# Altium schematic sheet Alimentation.SchDoc
size A4; Author: Jérémie Jean-Elie; Organization: ETML-ES; Address1: Avenue Recordon 1; Address2: 1004 Lausanne; Address3: Switzerland; Revision: 1; SheetNumber: 2; SheetTotal: 7; Version: E
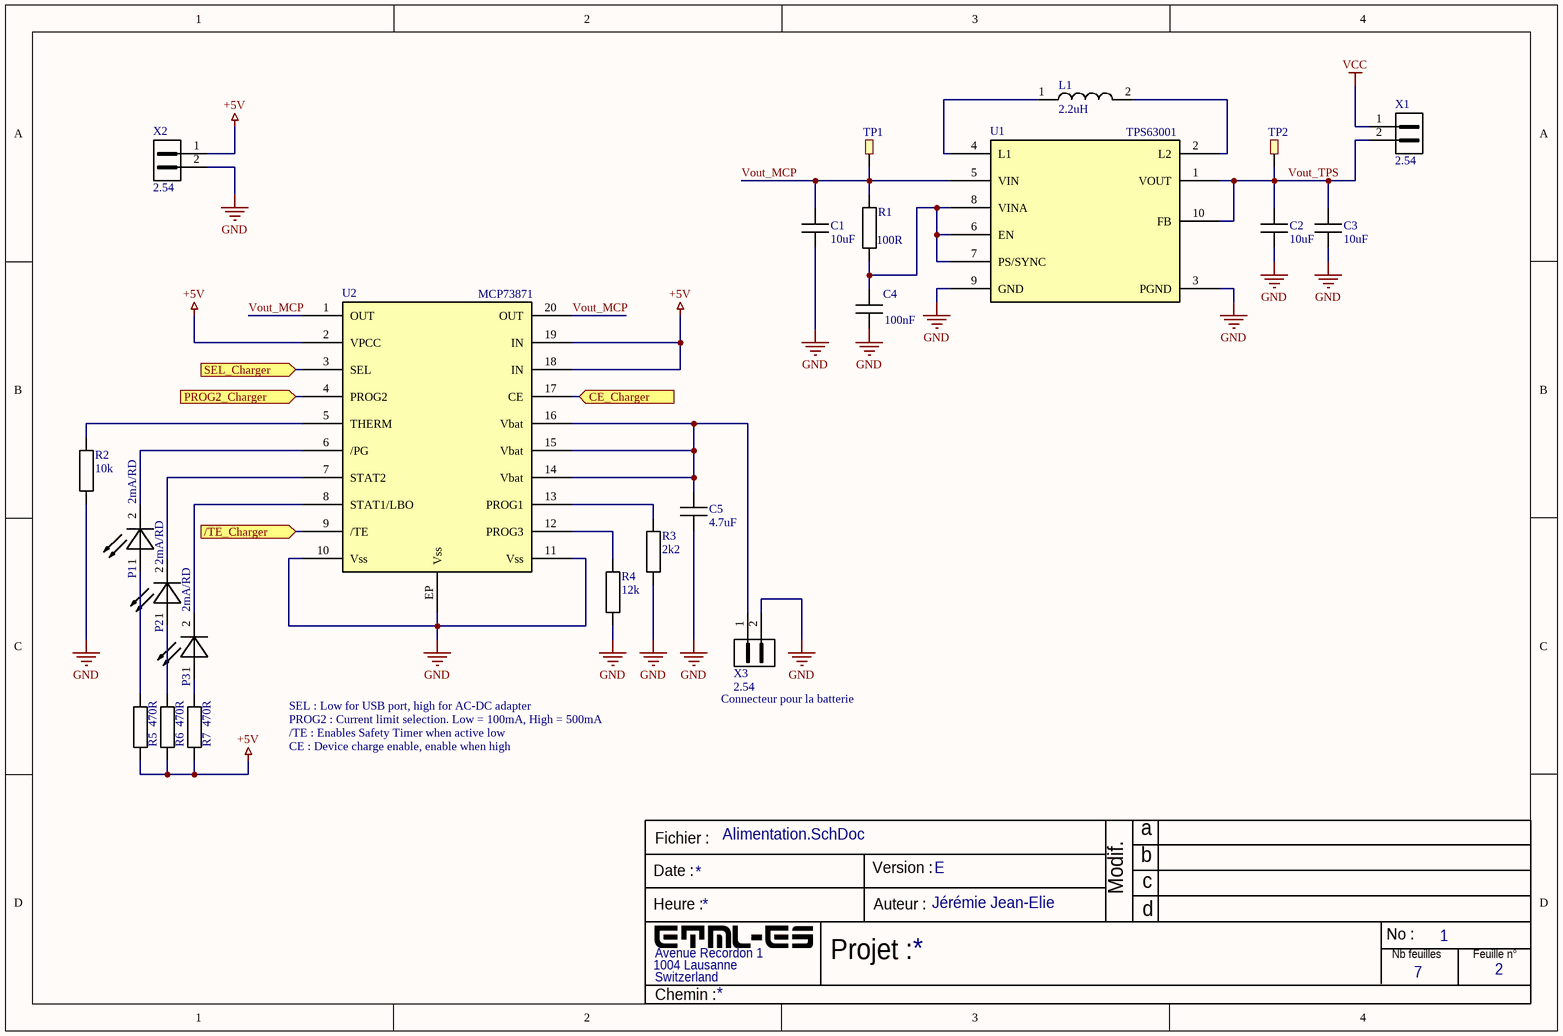
[diagram p0: Alimentation.SchDoc]

## Parts
C1  10uF  [CAPC1608X08M]
C2  10uF  [CAPC1608X08M]
C3  10uF  [CAPC1608X08M]
C4  100nF  [CAPC1608X08M]
C5  4.7uF  [CAPC1608X08M]
L1  2.2uH  [IND_2.2uH]
P1  2mA/RD  [LED-PLCC2]
P2  2mA/RD  [LED-PLCC2]
P3  2mA/RD  [LED-PLCC2]
R1  100R  [RESC1608X06M]
R2  10k  [RESC1608X06M]
R3  2k2  [RESC1608X06M]
R4  12k  [RESC1608X06M]
R5  470R  [RESC1608X06M]
R6  470R  [RESC1608X06M]
R7  470R  [RESC1608X06M]
TP1  TestPoint  [KEYSTONE_5019]  (value not drawn)
TP2  TestPoint  [KEYSTONE_5019]  (value not drawn)
U1  TPS63001  [DRC0010J]
U2  MCP73871  [QFN50P400X400X100_HS-21N]
X1  2.54  [PIN-1x02-2.54]
X2  2.54  [PIN-1x02-2.54]
X3  2.54  [PIN-1x02-2.54]

## Ports
/TE_Charger (in, see Schema_bloc[2A], Microcontroleur[4B]), CE_Charger (in, see Schema_bloc[2A], Microcontroleur[4B]), PROG2_Charger (in, see Schema_bloc[2A], Microcontroleur[4B]), SEL_Charger (in, see Schema_bloc[2A], Microcontroleur[4B])

## Nets
+5V: R5.1 R6.1 R7.1 U2.2(VPCC) U2.18(IN) U2.19(IN) X2.1
GND: C1.1 C2.1 C3.1 C4.1 C5.1 R2.1 R3.1 R4.1 U1.3(PGND) U1.9(GND) U2.10(Vss) U2.11(Vss) U2.EP(Vss) X2.2 X3.2
VCC: X1.1
/TE_Charger: U2.9(/TE) ; port /TE_Charger
CE_Charger: U2.17(CE) ; port CE_Charger
PROG2_Charger: U2.4(PROG2) ; port PROG2_Charger
SEL_Charger: U2.3(SEL) ; port SEL_Charger
Vout_MCP: C1.2 R1.2 TP1.1 U1.5(VIN) U2.1(OUT) U2.20(OUT)
Vout_TPS: C2.2 C3.2 TP2.1 U1.1(VOUT) U1.10(FB) X1.2
NetC4_2: C4.2 R1.1 U1.6(EN) U1.7(PS/SYNC) U1.8(VINA)
NetC5_2: C5.2 U2.14(Vbat) U2.15(Vbat) U2.16(Vbat) X3.1
NetL1_1: L1.1 U1.4(L1)
NetL1_2: L1.2 U1.2(L2)
NetP1_1: P1.1(A) R5.2
NetP1_2: P1.2(K) U2.6(/PG)
NetP2_1: P2.1(A) R6.2
NetP2_2: P2.2(K) U2.7(STAT2)
NetP3_1: P3.1(A) R7.2
NetP3_2: P3.2(K) U2.8(STAT1/LBO)
NetR2_2: R2.2 U2.5(THERM)
NetR3_2: R3.2 U2.13(PROG1)
NetR4_2: R4.2 U2.12(PROG3)

## Notes on the sheet
- SEL : Low for USB port, high for AC-DC adapter
- Connecteur pour la batterie
- PROG2 : Current limit selection. Low = 100mA, High = 500mA
- /TE : Enables Safety Timer when active low
- CE : Device charge enable, enable when high
- Fichier :
- a
- Date :
- Heure :
- Version :
- Auteur :
- Modif.
- b
- c
- d
- Projet :
- No :
- Nb feuilles
- Feuille n°
- Chemin :

## Library data of the parts
C1-C3 = CMP-065-000003-2: CAPC 10uF X5R 10V 20% 1608 (0603 INCH); Manufacturer: TDK; Manufacturer Number: C1608X5R1A106M080AC; TemperatureRange: -55°C to +85°C; IsStocked: 1; Value: 10µF; PN: PN-131657; Supplier Price 1: 0.0944; Tolerance: ±20%; Category: Passives; Dielectric: X5R; SubCategory: Condensateurs ceramique; Supplier 1: ETML; Voltage: 10V; Supplier Part Number 1: FAB.0603_C 10uF
C4 = CMP-065-000000-2: CAPC 100nF X7R 50V 10% 1608 (0603 INCH); Manufacturer: TDK; Manufacturer Number: CGA3E2X7R1H104K080AA; IsStocked: 1; PN: PN-338083; Current: NULL; TemperatureRange: -55°C to +125°C; Voltage: 50V; Dielectric: X7R; Value: 100nF; Category: Passives; Supplier Price 1: 0.0100; Supplier Part Number 1: FAB.0603_C 100n; SubCategory: Condensateurs ceramique; Tolerance: ±10%; Supplier 1: ETML; TemperatureCoeff: NULL; Power: NULL
C5 = CMP-065-000006-2: CAPC 4.7uF X5R 16V 10% 1608 (0603 INCH); Manufacturer: TDK; Manufacturer Number: C1608X5R1C475K080AC; TemperatureRange: -55°C to +85°C; IsStocked: 1; Value: 4.7µF; PN: PN-938781; Voltage: 16V; SubCategory: Condensateurs ceramique; Tolerance: ±10%; Dielectric: X5R; Supplier Price 1: 0.0453; Supplier Part Number 1: FAB.0603_C 4.7uF; Supplier 1: ETML; Category: Passives
P1-P3 = CMP-062-000009-1: LED 2 mA 2.2V 625nm Red PLCC2; Manufacturer Number: VLMT3100-GS08; Manufacturer: Vishay; Current: 2mA; TemperatureRange: -40°C to +100°C; PN: PN-800195; IsStocked: True; Supplier 1: Farnell; Value: 2mA/RD; Category: Optoelectronics; Supplier Price 1: 0.179; Supplier Part Number 1: 2251489; Voltage: 2.2V; SubCategory: Leds
R1 = CMP-066-000100-2: RES 100ohm  ±1% 0.1W  1608 (0603 INCH); Manufacturer Number: RC0603FR-07100RL; Manufacturer: Yageo; TemperatureCoeff: ±100ppm/°C; Voltage: 75V; PN: PN-739787; TemperatureRange: -55°C to 155°C; Value: 100; IsStocked: 1; Supplier Price 1: 0.0200; Category: Passives; Tolerance: ±1%; Supplier 1: ETML; Supplier Part Number 1: FAB.0603_R 100R; Power: 0.1W; SubCategory: Resistances couche epaisse
R2 = CMP-066-000124-2: RES 10kohm  ±1% 0.1W  1608 (0603 INCH); Manufacturer Number: RC0603FR-0710KL; Manufacturer: Yageo; TemperatureRange: -55°C to 155°C; Voltage: 75V; TemperatureCoeff: ±100ppm/°C; PN: PN-896786; IsStocked: 1; Category: Passives; Tolerance: ±1%; Value: 10k; Supplier Part Number 1: FAB.0603_R 10k; Power: 0.1W; Supplier Price 1: 0.0200; Supplier 1: ETML; SubCategory: Resistances couche epaisse
R3 = CMP-066-000116-2: RES 2.2kohm  ±1% 0.1W  1608 (0603 INCH); Manufacturer Number: RC0603FR-072K2L; Manufacturer: Yageo; TemperatureCoeff: ±100ppm/°C; TemperatureRange: -55°C to 155°C; IsStocked: 1; Voltage: 75V; PN: PN-844453; Value: 2.2k; Power: 0.1W; Category: Passives; Supplier Part Number 1: FAB.0603_R 2k2; Supplier 1: ETML; SubCategory: Resistances couche epaisse; Supplier Price 1: 0.0200; Tolerance: ±1%
R4 = CMP-066-000125-2: RES 12kohm  ±1% 0.1W  1608 (0603 INCH); Manufacturer Number: RC0603FR-0712KL; Manufacturer: Yageo; IsStocked: 1; Voltage: 75V; TemperatureCoeff: ±100ppm/°C; TemperatureRange: -55°C to 155°C; PN: PN-565828; Value: 12k; Tolerance: ±1%; Supplier Price 1: 0.0200; Supplier Part Number 1: FAB.0603_R 12k; Power: 0.1W; Category: Passives; SubCategory: Resistances couche epaisse; Supplier 1: ETML
R5-R7 = CMP-066-000108-2: RES 470ohm  ±1% 0.1W  1608 (0603 INCH); Manufacturer Number: RC0603FR-07470RL; Manufacturer: Yageo; Voltage: 75V; Value: 470; TemperatureCoeff: ±100ppm/°C; PN: PN-792120; TemperatureRange: -55°C to 155°C; IsStocked: 1; SubCategory: Resistances couche epaisse; Power: 0.1W; Tolerance: ±1%; Category: Passives; Supplier 1: ETML; Supplier Price 1: 0.0200; Supplier Part Number 1: FAB.0603_R 470R
X1-X3 = CMP-055-000006-1: PIN HEADER 2.54 1x02; Manufacturer Number: 61300211121; Manufacturer: Würth Electronik; IsStocked: True; PN: PN-573903; Voltage: 250V; Current: 3A; TemperatureRange: -40°C to +105°C; Supplier Part Number 1: MAG.283.897; Supplier Price 1: 0.04; Supplier 1: ETML; SubCategory: Pin Header; Category: Connectors; Value: 2.54
U1 = TPS63001: Supplier 1: DigiKey; Supplier Part Number 1: 296-32517-1-ND